# Altium schematic sheet PacBot.SchDoc: PacBot PCB
size A3; DrawnBy: Jack Wang; SheetNumber: 1; SheetTotal: 1
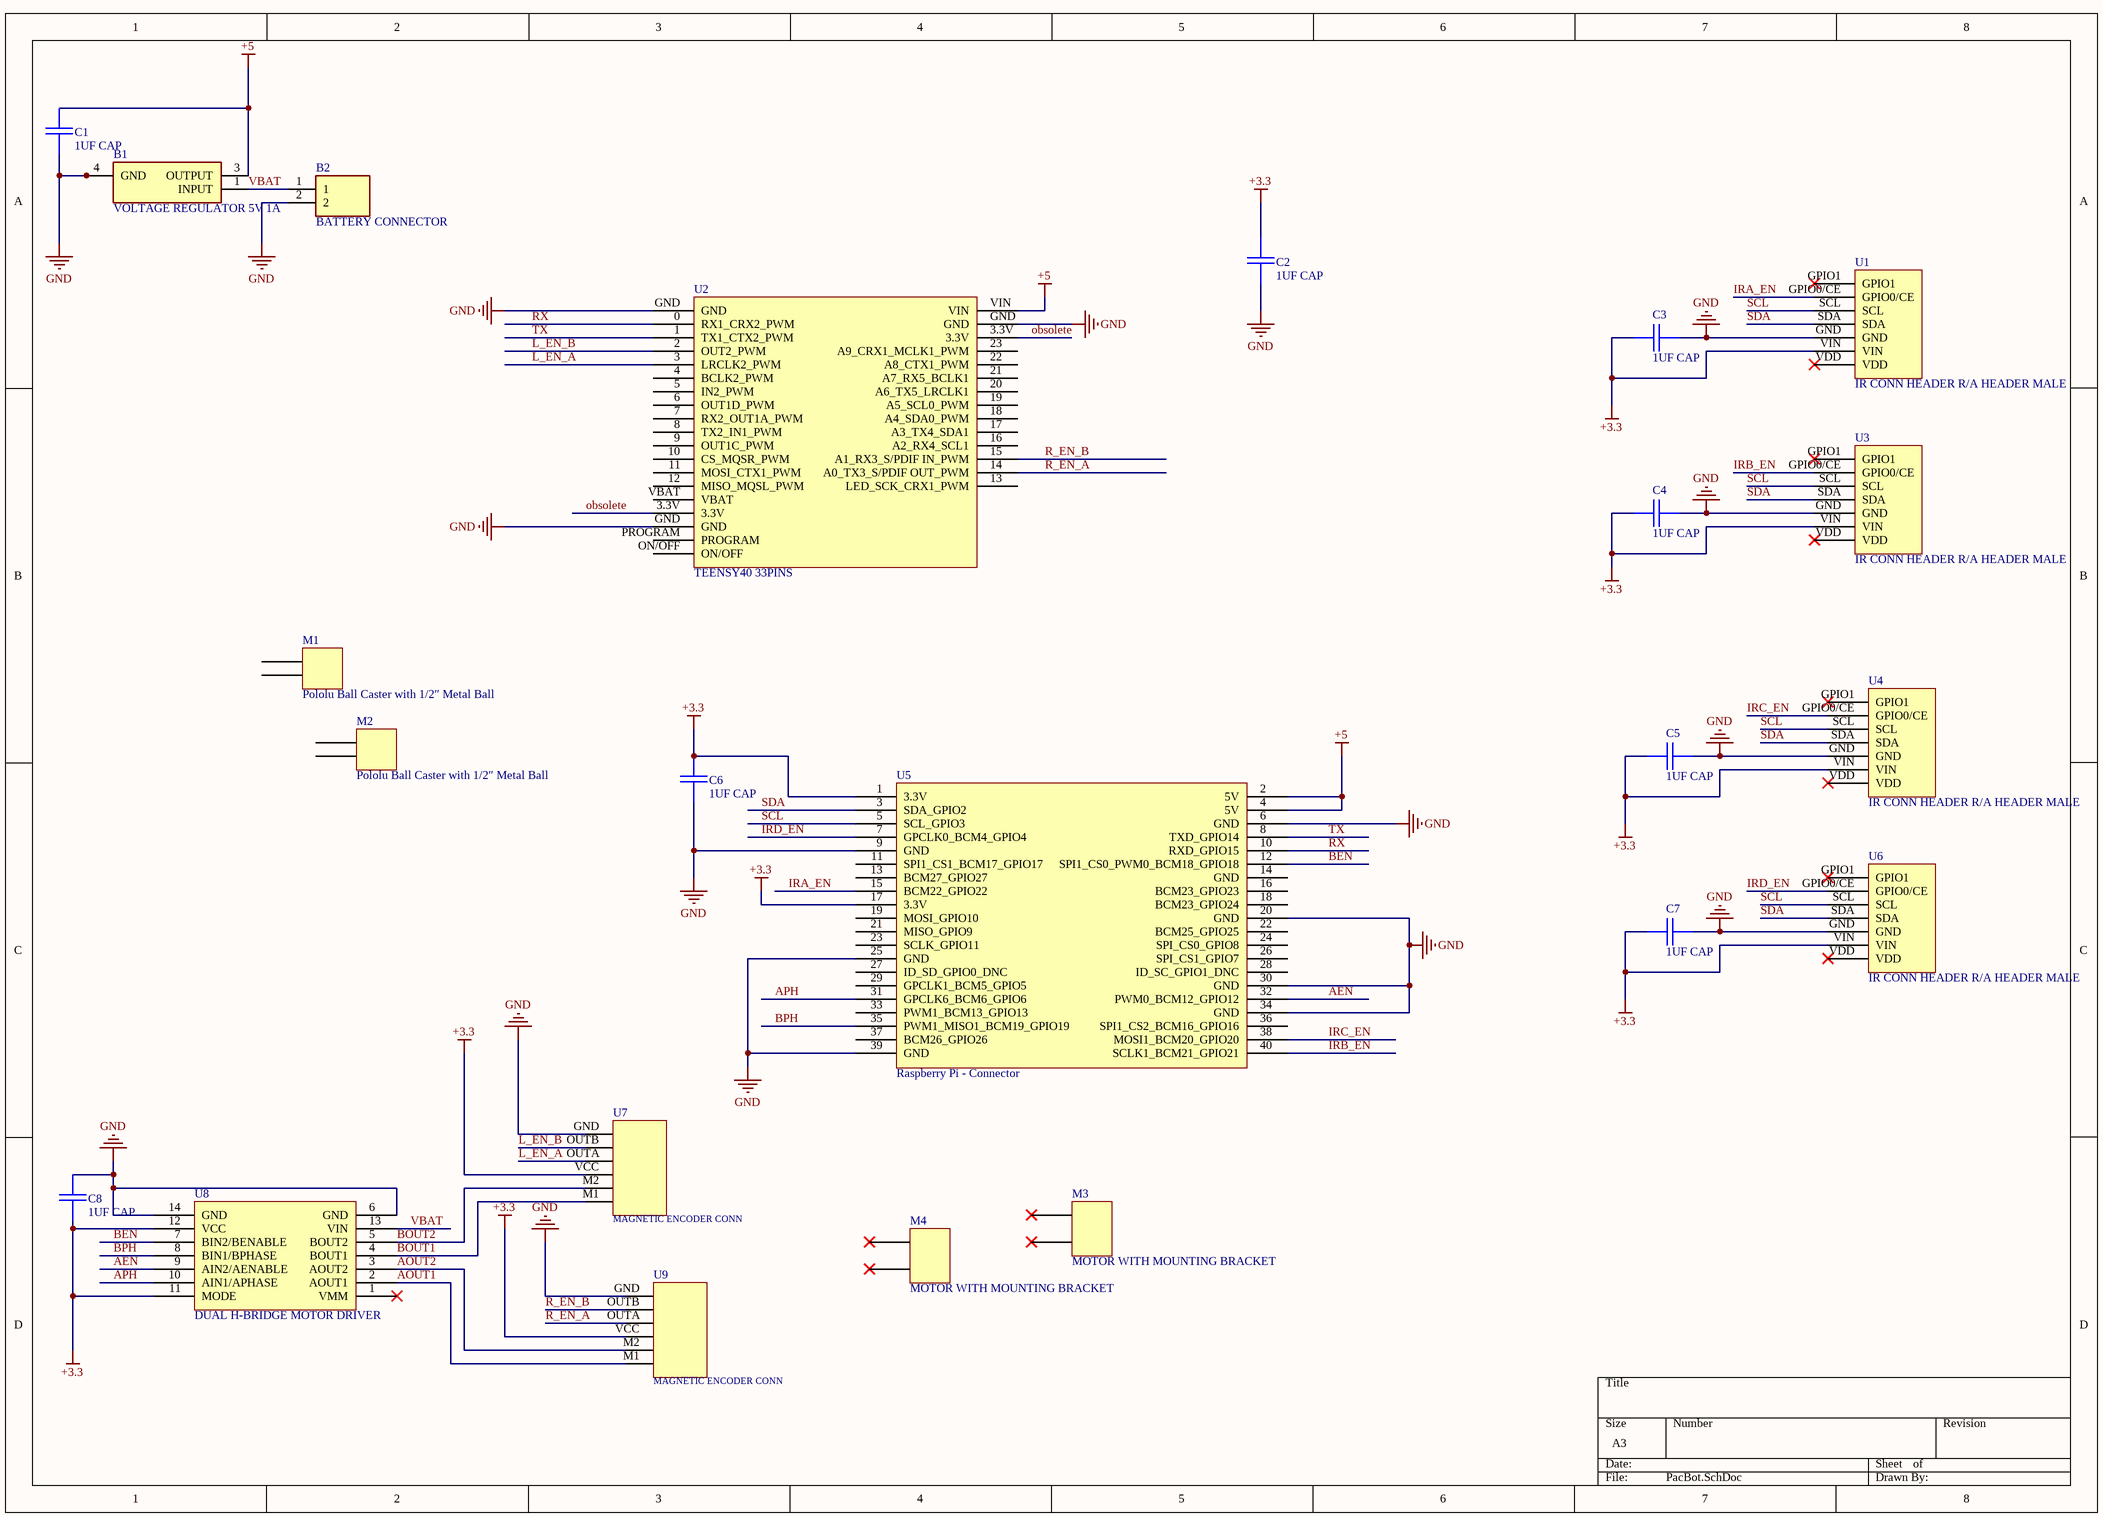
[diagram p0: PacBot.SchDoc]

## Parts
B1  VOLTAGE REGULATOR 5V 1A  [D2PAK-STB35NF10T4]
B2  BATTERY CONNECTOR  [TE_440054-2]
C1  1UF CAP  [CAPC1608X90N]
C2  1UF CAP  [CAPC1608X90N]
C3  1UF CAP  [CAPC1608X90N]
C4  1UF CAP  [CAPC1608X90N]
C5  1UF CAP  [CAPC1608X90N]
C6  1UF CAP  [CAPC1608X90N]
C7  1UF CAP  [CAPC1608X90N]
C8  1UF CAP  [CAPC1608X90N]
M1  Pololu Ball Caster with 1/2″ Metal Ball  [Ball_Caster]
M2  Pololu Ball Caster with 1/2″ Metal Ball  [Ball_Caster]
M3  MOTOR WITH MOUNTING BRACKET  [MOTOR]
M4  MOTOR WITH MOUNTING BRACKET  [MOTOR]
U1  IR CONN HEADER R/A HEADER MALE  [VL6180X]
U2  TEENSY40 33PINS  [TEENSY40]
U3  IR CONN HEADER R/A HEADER MALE  [VL6180X]
U4  IR CONN HEADER R/A HEADER MALE  [VL6180X]
U5  Raspberry Pi - Connector  [RPY]
U6  IR CONN HEADER R/A HEADER MALE  [VL6180X]
U7  MAGNETIC ENCODER CONN  [61300611121]
U8  DUAL H-BRIDGE MOTOR DRIVER  [DRV8835]
U9  MAGNETIC ENCODER CONN  [61300611121]

## Nets
+3.3: C2.1 C3.1 C4.1 C5.1 C6.2 C7.1 C8.1 U1.VIN U3.VIN U4.VIN U5.1(3.3V) U5.17(3.3V) U6.VIN U7.VCC U8.11(MODE) U8.12(VCC) U9.VCC
+5: B1.3(OUTPUT) C1.1 U2.VIN U5.2(5V) U5.4(5V)
GND: B1.4(GND) B2.2 C1.2 C2.2 C3.2 C4.2 C5.2 C6.1 C7.2 C8.2 U1.GND U2.GND U3.GND U4.GND U5.6(GND) U5.9(GND) U5.20(GND) U5.25(GND) U5.30(GND) U5.34(GND) U5.39(GND) U6.GND U7.GND U8.6(GND) U8.14(GND) U9.GND
AEN: U5.32(PWM0_BCM12_GPIO12) U8.9(AIN2/AENABLE)
AOUT1: U8.2(AOUT1) U9.M1
AOUT2: U8.3(AOUT2) U9.M2
APH: U5.31(GPCLK6_BCM6_GPIO6) U8.10(AIN1/APHASE)
BEN: U5.12(SPI1_CS0_PWM0_BCM18_GPIO18) U8.7(BIN2/BENABLE)
BOUT1: U7.M1 U8.4(BOUT1)
BOUT2: U7.M2 U8.5(BOUT2)
BPH: U5.35(PWM1_MISO1_BCM19_GPIO19) U8.8(BIN1/BPHASE)
IRA_EN: U1.GPIO0/CE U5.15(BCM22_GPIO22)
IRB_EN: U3.GPIO0/CE U5.40(SCLK1_BCM21_GPIO21)
IRC_EN: U4.GPIO0/CE U5.38(MOSI1_BCM20_GPIO20)
IRD_EN: U5.7(GPCLK0_BCM4_GPIO4) U6.GPIO0/CE
L_EN_A: U2.3(LRCLK2_PWM) U7.OUTA
L_EN_B: U2.2(OUT2_PWM) U7.OUTB
obsolete: U2.3.3V
R_EN_A: U2.14(A0_TX3_S/PDIF_OUT_PWM) U9.OUTA
R_EN_B: U2.15(A1_RX3_S/PDIF_IN_PWM) U9.OUTB
RX: U2.0(RX1_CRX2_PWM) U5.10(RXD_GPIO15)
SCL: U1.SCL U3.SCL U4.SCL U5.5(SCL_GPIO3) U6.SCL
SDA: U1.SDA U3.SDA U4.SDA U5.3(SDA_GPIO2) U6.SDA
TX: U2.1(TX1_CTX2_PWM) U5.8(TXD_GPIO14)
VBAT: B1.1(INPUT) B2.1 U8.13(VIN)

Not connected (* = marked no-connect by the designer): M1 1 2; M2 1 2; M3 1* VDD*; M4 1* VDD*; U1 GPIO1* VDD*; U2 4(BCLK2_PWM) 5(IN2_PWM) 6(OUT1D_PWM) 7(RX2_OUT1A_PWM) 8(TX2_IN1_PWM) 9(OUT1C_PWM) 10(CS_MQSR_PWM) 11(MOSI_CTX1_PWM) 12(MISO_MQSL_PWM) 13(LED_SCK_CRX1_PWM) 16(A2_RX4_SCL1) 17(A3_TX4_SDA1) 18(A4_SDA0_PWM) 19(A5_SCL0_PWM) 20(A6_TX5_LRCLK1) 21(A7_RX5_BCLK1) 22(A8_CTX1_PWM) 23(A9_CRX1_MCLK1_PWM) ON/OFF PROGRAM VBAT; U3 GPIO1* VDD*; U4 GPIO1* VDD*; U5 11(SPI1_CS1_BCM17_GPIO17) 13(BCM27_GPIO27) 14(GND) 16(BCM23_GPIO23) 18(BCM23_GPIO24) 19(MOSI_GPIO10) 21(MISO_GPIO9) 22(BCM25_GPIO25) 23(SCLK_GPIO11) 24(SPI_CS0_GPIO8) 26(SPI_CS1_GPIO7) 27(ID_SD_GPIO0_DNC) 28(ID_SC_GPIO1_DNC) 29(GPCLK1_BCM5_GPIO5) 33(PWM1_BCM13_GPIO13) 36(SPI1_CS2_BCM16_GPIO16) 37(BCM26_GPIO26); U6 GPIO1* VDD*; U8 1(VMM)*

## Library data of the parts
B1 = L7805ACD2T-TR: Voltage Regulator 5V 1A D2PAK STMicroelectronics L78xx L7805ACD2T-TR, Single Linear Voltage Regulator, 1.5A 5 V, +/-2%, 3-Pin D2PAK; Additional Material: None; Mouser Part Number: 511-L7805ACD2T-TR; Mouser Price/Stock: https://www.mouser.co.uk/ProductDetail/STMicroelectronics/L7805ACD2T-TR?qs=Ctxo64yJVFuOLXlPPZdJUQ%3D%3D; Manufacturer: STMicroelectronics; Manufacture Number: L7805ACD2T-TR; Datasheet Link: http://www.st.com/web/en/resource/technical/document/datasheet/CD00000444.pdf; ComponentLink1Description: Product URL; ComponentLink1URL: https://www.mouser.com/ProductDetail/STMicroelectronics/L7805ACD2T-TR?qs=Ctxo64yJVFuOLXlPPZdJUQ%3D%3D; ComponentLink2Description: Additional Material Link; ComponentLink2URL: None; Additional Material Link: None; Product URL: https://www.mouser.com/ProductDetail/STMicroelectronics/L7805ACD2T-TR?qs=Ctxo64yJVFuOLXlPPZdJUQ%3D%3D
B2 = 440054-2: HPI Series; 2mm Pitch 2 Way 1 Row Straight PCB Header; Solder Termination; 3A; Manufacturer: TE Connectivity; Additional Material: 2xfemale dupont wire; Check_prices: https://www.snapeda.com/parts/440054-2/TE+Connectivity+AMP+Connectors/view-part/?ref=eda; Purchase-URL: https://pricing.snapeda.com/search/part/440054-2/?ref=eda; Price: None; MP: 440054-2; EU_RoHS_Compliance: Compliant; SnapEDA_Link: https://www.snapeda.com/parts/440054-2/TE+Connectivity+AMP+Connectors/view-part/?ref=snap; Availability: In Stock; Package: None; ComponentLink1Description: Product URL; ComponentLink1URL: https://www.te.com/usa-en/product-440054-2.html; Manufacture Number: 440054-2; ComponentLink2Description: Additional Material Link; ComponentLink2URL: https://www.pololu.com/category/298/ribbon-cable-premium-jumper-wires; Additional Material Link: https://www.pololu.com/category/298/ribbon-cable-premium-jumper-wires; Product URL: https://www.te.com/usa-en/product-440054-2.html
C1-C8 = GRM188R60J105KA01D: SMD Capacitor X5R(EIA) with Capacitance: 1.0uF Tol. 10%. Rated Voltage: 6.3Vdc; Manufacturer: Murata Electronics; Additional Material: None; DigiKey-Purchase-URL: https://snapeda.com/shop?store=DigiKey&id=341022; SnapEDA_Link: https://www.snapeda.com/parts/GRM188R60J105KA01D/Murata%20Electronics%20North%20America/view-part/341022/?ref=snap; Manufacture Number: GRM188R60J105KA01D; Value: *; Package: 1608 Murata; Digi-Key_Part_Number: 490-1550-1-ND; ComponentLink1Description: Product URL; ComponentLink1URL: https://www.digikey.com/en/products/detail/GRM188R60J105KA01D/490-1550-1-ND/587755?curr=usd&utm_campaign=buynow&utm_medium=aggregator&utm_source=octopart; ComponentLink2Description: Additional Material Link; ComponentLink2URL: None; Additional Material Link: None; Product URL: https://www.digikey.com/en/products/detail/GRM188R60J105KA01D/490-1550-1-ND/587755?curr=usd&utm_campaign=buynow&utm_medium=aggregator&utm_source=octopart
M1 M2 = Ball_Caster: This ball caster uses a 1/2″ diameter metal ball. The height of the assembled kit ranges from 0.5″ to 0.8″, depending on the combination of included spacers used.; Manufacture Number: 953; Additional Material: 2*M2 screws and nuts for each ball caster; Manufacturer: Pololu; ComponentLink1Description: Product URL; ComponentLink1URL: https://www.pololu.com/product/953/resources; ComponentLink2Description: Additional Material Link; ComponentLink2URL: None; Additional Material Link: None; Product URL: https://www.pololu.com/product/953/resources
M3 M4 = MOTOR: Manufacturer: Pololu; Manufacture Number: 2379; Additional Material: Pololu Micro Metal Gearmotor Bracket Pair - Black; Additional Material Link: https://www.pololu.com/product/989/resources; Product URL: https://www.pololu.com/product/2379/resources
U1 U3 U4 U6 = VL6180X: This sensor is a carrier/breakout board for ST’s VL6180X proximity and ambient light sensor, which measures the range to a target object up to 20 cm away (or 60 cm with reduced resolution). The VL6180X uses time-of-flight measurements of infrared pulses for ranging, allowing it to give accurate results independent of the target’s color and surface. Distance and ambient light level measurements can be read through a digital I²C interface. The board has a 2.8 V linear regulator and integrated level-shifters that allow it to work over an input voltage range of 2.7 V to 5.5 V, and the 0.1″ pin spacing makes it easy to use with standard solderless breadboards and 0.1″ perfboards.; Manufacturer: Digi-Key; Manufacturer Number: 2057-PH1RB-14-UA-ND; Additional Material: 7-Pin R/A Male headers per IR; ComponentLink1Description: datasheet; ComponentLink1URL: https://www.st.com/resource/en/datasheet/vl6180x.pdf; ComponentLink2Description: Product URL; ComponentLink2URL: https://www.pololu.com/product/2489/resources; ComponentLink3Description: Additional Material Link; ComponentLink3URL: https://www.digikey.com/en/products/detail/adam-tech/PH1RB-14-UA/9831063?utm_adgroup=Rectangular%20Connectors%20-%20Headers%2C%20Male%20Pins&utm_source=google&utm_medium=cpc&utm_campaign=Shopping_Product_Connectors%2C%20Interconnects_NEW&utm_term=&utm_content=Rectangular%20Connectors%20-%20Headers%2C%20Male%20Pins&gclid=CjwKCAjw_MqgBhAGEiwAnYOAejAbtTqXabENRAXP2u8fN9nntNeUbVp1pwD-yYO_9saqioDVWyq7vhoCJtIQAvD_BwE; Additional Material Link: https://www.digikey.com/en/products/detail/adam-tech/PH1RB-14-UA/9831063?utm_adgroup=Rectangular%20Connectors%20-%20Headers%2C%20Male%20Pins&utm_source=google&utm_medium=cpc&utm_campaign=Shopping_Product_Connectors%2C%20Interconnects_NEW&utm_term=&utm_content=Rectangular%20Connectors%20-%20Headers%2C%20Male%20Pins&gclid=CjwKCAjw_MqgBhAGEiwAnYOAejAbtTqXabENRAXP2u8fN9nntNeUbVp1pwD-yYO_9saqioDVWyq7vhoCJtIQAvD_BwE; Product URL: https://www.pololu.com/product/2489/resources
U2 = TEENSY40: Teensy USB Board, Version 4.0. 32 bits arduino compatible microcontroller; Manufacturer: PJRC Store; Additional Material: 33-Pin male headers per Teensy; Manufacture Number: TEENSY40; ComponentLink1Description: Product URL; ComponentLink1URL: https://www.pjrc.com/store/teensy40.html; ComponentLink2Description: Additional Material Link; ComponentLink2URL: https://www.pololu.com/product/965; Additional Material Link: https://www.pololu.com/product/965; Product URL: https://www.pjrc.com/store/teensy40.html
U5 = RPY: RASPBERRYPI GPIO MALE HEADER; Manufacturer: Mouser; Manufacture Number: 474-PRT-14275; Additional Material: 40-Pin RaspberryPi GPIO header per PI; ComponentLink1Description: Product URL; ComponentLink1URL: https://www.raspberrypi.com/products/raspberry-pi-zero-w/; ComponentLink2Description: Additional Material Link; ComponentLink2URL: https://www.digikey.com/en/products/detail/PRT-14275/1568-1675-ND/7428264?curr=usd&utm_campaign=buynow&utm_medium=aggregator&utm_source=octopart; Additional Material Link: https://www.digikey.com/en/products/detail/PRT-14275/1568-1675-ND/7428264?curr=usd&utm_campaign=buynow&utm_medium=aggregator&utm_source=octopart; Product URL: https://www.raspberrypi.com/products/raspberry-pi-zero-w/
U7 U9 = CMP-1502-01070-1: THT Vertical Pin Header WR-PHD, Pitch 2.54 mm, Single Row, 6 pins; Manufacturer: Wurth Elektronik; Gender: Male; Pin Number: 6; Pitch: 2.54mm; Working Voltage: 250VAC; Rated Current: 3A; Withstanding Voltage: 500VAC; Contact Resistance: 20mOhm; Additional Material: 6*female dupont wire per header; Operating Temperature: -40to105degC; Packaging: Bag; Datasheet URL: https://katalog.we-online.de/em/datasheet/6130xx11121.pdf; Package Reference: 61300611121; Mounting Technology: THT; Publisher: WurthElektronik; Manufacture Number: 61300611121; Manufacturer URL: http://www.we-online.de; Row Number: Single; Orientation: Vertical; ComponentLink1Description: Product URL; ComponentLink1URL: https://www.digikey.com/en/products/detail/w%C3%BCrth-elektronik/61300611121/4846833?utm_adgroup=Rectangular%20Connectors%20-%20Headers%2C%20Male%20Pins&utm_source=google&utm_medium=cpc&utm_campaign=Shopping_Product_Connectors%2C%20Interconnects_NEW&utm_term=&utm_content=Rectangular%20Connectors%20-%20Headers%2C%20Male%20Pins&gclid=Cj0KCQiApKagBhC1ARIsAFc7Mc4_cjqnefrDzrpu3JapJRnikEceUeu0HkZKl_cbgEqDj7lyXJ1YyUwaAuZSEALw_wcB; ComponentLink2Description: Additional Material Link; ComponentLink2URL: https://www.pololu.com/category/298/ribbon-cable-premium-jumper-wires; Additional Material Link: https://www.pololu.com/category/298/ribbon-cable-premium-jumper-wires; Product URL: https://www.digikey.com/en/products/detail/w%C3%BCrth-elektronik/61300611121/4846833?utm_adgroup=Rectangular%20Connectors%20-%20Headers%2C%20Male%20Pins&utm_source=google&utm_medium=cpc&utm_campaign=Shopping_Product_Connectors%2C%20Interconnects_NEW&utm_term=&utm_content=Rectangular%20Connectors%20-%20Headers%2C%20Male%20Pins&gclid=Cj0KCQiApKagBhC1ARIsAFc7Mc4_cjqnefrDzrpu3JapJRnikEceUeu0HkZKl_cbgEqDj7lyXJ1YyUwaAuZSEALw_wcB
U8 = DRV8835: Texas Instruments’ DRV8835 is a tiny dual H-bridge motor driver IC that can be used for bidirectional control of two brushed DC motors at 0 V to 11 V.; Manufacturer: Pololu; Manufacture Number: 2135; Additional Material: 2*7-pin 0.1'' male headers per unit; ComponentLink1Description: Product URL; ComponentLink1URL: https://www.pololu.com/product/2135/specs; ComponentLink2Description: Additional Material Link; ComponentLink2URL: https://www.pololu.com/product/965; Additional Material Link: https://www.pololu.com/product/965; Product URL: https://www.pololu.com/product/2135/specs